# EAGLE design main (EAGLE 9.0.0)
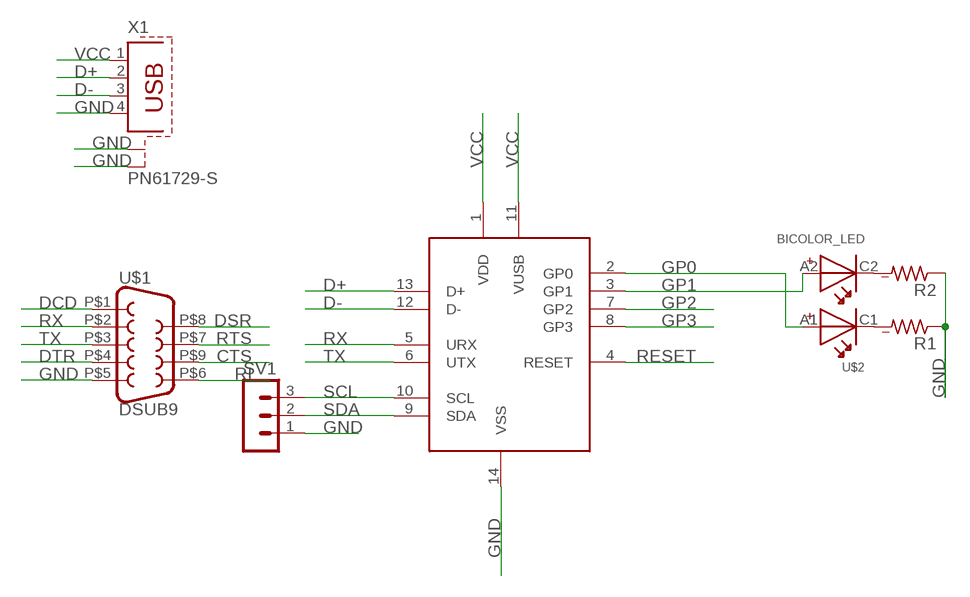
[diagram p0: schematic, sheet 1]

## Parts
BR1  MCP2221A  [DIP14]
R1  R-US_M0805  [M0805]
R2  R-US_M0805  [M0805]
SV1  MA03-1  [MA03-1]
U$1  DSUB9  [DSUB9_EDGECARD]
U$2  BICOLOR_LED  [BICOLOR_LED]
X1  PN61729-S  [PN61729-S]

## Nets
CTS: U$1.P$9(CTS)
D+: BR1.13(D+) X1.2
D-: BR1.12(D-) X1.3
DCD: U$1.P$1(DCD)
DSR: U$1.P$8(DSR)
DTR: U$1.P$4(DTR)
GND: BR1.14(VSS) R1.1 R2.1 SV1.1 U$1.P$5(GND) X1.4 X1.S1 X1.S2
GP0: BR1.2(GP0) U$2.A1
GP1: BR1.3(GP1) U$2.A2
GP2: BR1.7(GP2)
GP3: BR1.8(GP3)
N$1: R1.2 U$2.C1
N$2: R2.2 U$2.C2
RESET: BR1.4(RESET)
RI: U$1.P$6(RI)
RTS: U$1.P$7(RTS)
RX: BR1.5(URX) U$1.P$2(RXD)
SCL: BR1.10(SCL) SV1.3
SDA: BR1.9(SDA) SV1.2
TX: BR1.6(UTX) U$1.P$3(TXD)
VCC: BR1.1(VDD) BR1.11(VUSB) X1.1

## Library data of the parts
BR1 = 7_segment_lib:MCP2221A
R1 R2 = resistor:R-US_: RESISTOR, American symbol
SV1 = con-lstb:MA03-1: PIN HEADER; OC_FARNELL: unknown; OC_NEWARK: unknown
U$1 = 7_segment_lib:DSUB9
U$2 = 7_segment_lib:BICOLOR_LED
X1 = 7_segment_lib:PN61729-S: BERG USB connector; OC_FARNELL: unknown; OC_NEWARK: unknown

## Board
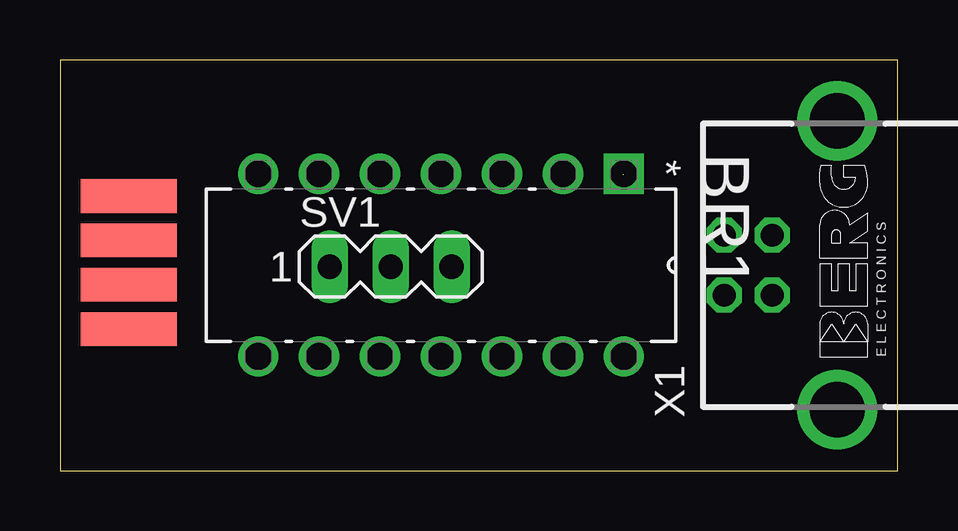
[diagram p1: board, top side]
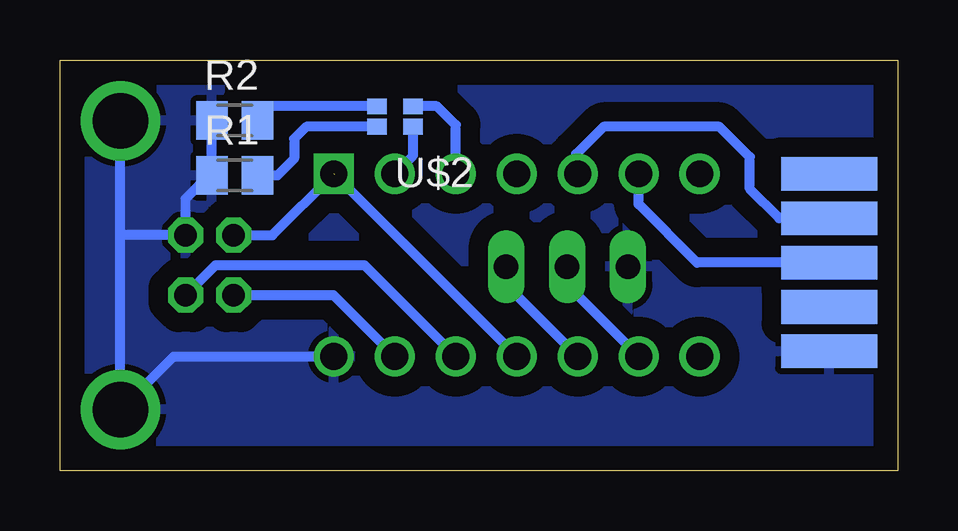
[diagram p2: board, bottom side, seen from below]

Size 34.91 x 17.13 mm. Coordinates in mm from the lower left corner, seen from the top.
Outline: 0,0 34.91,0 34.91,17.13 0,17.13 0,0
Copper layers (1*16): Top 0.035mm / dielectric 1.5mm / Bottom 0.035mm
Design rules "default": minimum track width 6mil, minimum drill 0.35mm, track to track 6mil, track to pad 6mil, pad to pad 6mil, via to via 6mil, smd to smd 6mil, copper to edge 40mil, drill to drill 6mil, minimum pad ring 10mil, minimum via ring 8mil, stop-mask expansion 4mil, vias tented up to drill 0mil, thermal gap 10mil

### Footprints (pad centres in the part's own frame; a part is rotated, then mirrored left to right if it is on the bottom)
DIP14 = drill 1.118 square: 1 -7.62,15.24 | drill 1.118: 2 -7.62,12.7; 3 -7.62,10.16; 4 -7.62,7.62; 5 -7.62,5.08; 6 -7.62,2.54; 7 -7.62,0; 8 0,0; 9 0,2.54; 10 0,5.08; 11 0,7.62; 12 0,10.16; 13 0,12.7; 14 0,15.24
M0805 = smd 1.3 x 1.6: 1 -0.95,0; 2 0.95,0
MA03-1 = drill 1.016 long: 1 -2.54,0; 2 0,0; 3 2.54,0
DSUB9_EDGECARD = smd 1.4 x 4: P$1 0,0; P$2 -1.85,0; P$3 -3.7,0; P$4 -5.55,0; P$5 -7.4,0 | smd 1.4 x 4 bottom: P$6 -6.475,0; P$7 -4.625,0; P$8 -2.775,0; P$9 -0.925,0
BICOLOR_LED = smd 0.8 x 0.65: A1 0,0; A2 0,-0.85; C1 1.5,0; C2 1.5,-0.85
PN61729-S = drill 0.95 octagon: 1 1.25,4.71; 2 -1.25,4.71; 3 -1.25,2.71; 4 1.25,2.71 | drill 2.3 pad 2.9: S1 -6.02,0; S2 6.02,0

### Placement (x,y rotation side)
BR1  8.25,4.76 270 top
R1  27.62,12.32 0 bottom
R2  27.62,14.61 0 bottom
SV1  13.78,8.51 0 top
U$1  2.86,12.38 90 bottom
U$2  20.19,14.35 180 bottom
X1  32.39,8.57 90 top

### Tracks (layer width: path | path; a pad name or v marks a point on that pad's centre or on a via)
D+
  Bottom 0.406: X1.2 23.52,7.32 BR1.13
D-
  Bottom 0.406: X1.3 28.43,8.57 22.22,8.57 BR1.12
GND
  Bottom 0.406: 32.39,9.78 X1.S1 30.18,4.76 BR1.14 | 32.39,9.78 X1.S2 | 32.39,9.78 32.34,9.82 X1.4 29.68,11.34 28.57,12.45 | R1.1 28.57,12.45 | 28.57,12.45 R2.1
  pour Bottom (isolate 0.813): -0.25,17.21 34.67,17.21 34.67,-0.25 -0.25,-0.25
GP0
  Bottom 0.406: BR1.2 20.19,13.14 U$2.A1
GP1
  Bottom 0.406: BR1.3 18.41,14.41 19.2,15.2 U$2.A2
N$1
  Bottom 0.406: U$2.C1 24.64,14.35 25.15,13.84 25.15,13.02 25.84,12.32 R1.2
N$2
  Bottom 0.406: U$2.C2 26.08,15.2 R2.2
RX
  Bottom 0.406: U$1.P$2 4.94,10.53 6.16,11.75 6.16,13.08 7.43,14.35 12.26,14.35 13.4,13.21 13.4,12.45 BR1.5
SCL
  Bottom 0.406: BR1.10 16.32,7.75 SV1.3
SDA
  Bottom 0.406: BR1.9 13.78,7.75 SV1.2
TX
  Bottom 0.406: U$1.P$3 8.36,8.68 10.8,11.11 BR1.6
VCC  (1 unrouted)
  Bottom 0.406: BR1.11 23.46,12.35 | X1.1 26.05,9.82 BR1.1